# Altium project InterfaceSDRAM.PrjPcb
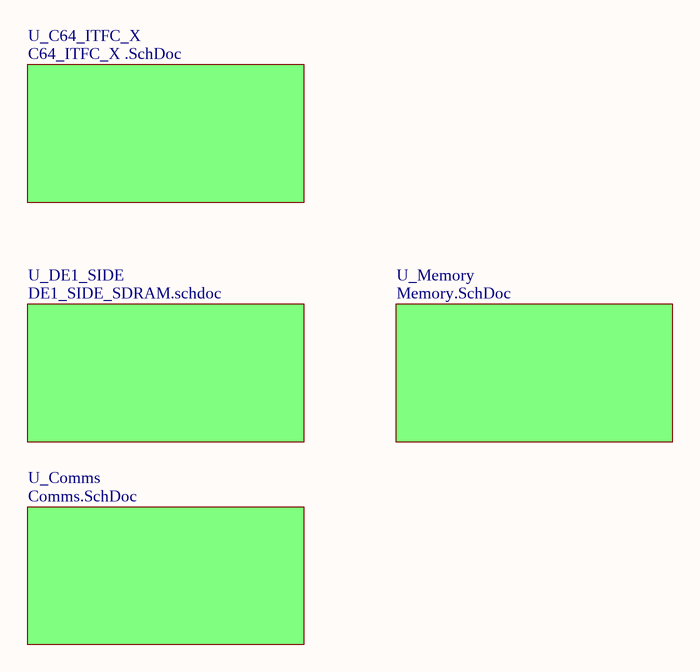
[diagram p0: C64IntfcTop.SchDoc]
5 sheets, 100 parts. Net scope: global (net labels, ports and power ports of the same name join across sheets).
Sheets:
  C64IntfcTop.SchDoc
    U_DE1_SIDE = DE1_SIDE_SDRAM.schdoc
    U_Memory = Memory.SchDoc
    U_Comms = Comms.SchDoc
    U_C64_ITFC_X = C64_ITFC_X .SchDoc

## Sheet C64IntfcTop.SchDoc
size A

### Sub-sheets
U_C64_ITFC_X = C64_ITFC_X .SchDoc: no entries
U_Comms = Comms.SchDoc: no entries
U_DE1_SIDE = DE1_SIDE_SDRAM.schdoc: no entries
U_Memory = Memory.SchDoc: no entries

## Sheet DE1_SIDE_SDRAM.schdoc
size B; SheetNumber: 3; SheetTotal: 3
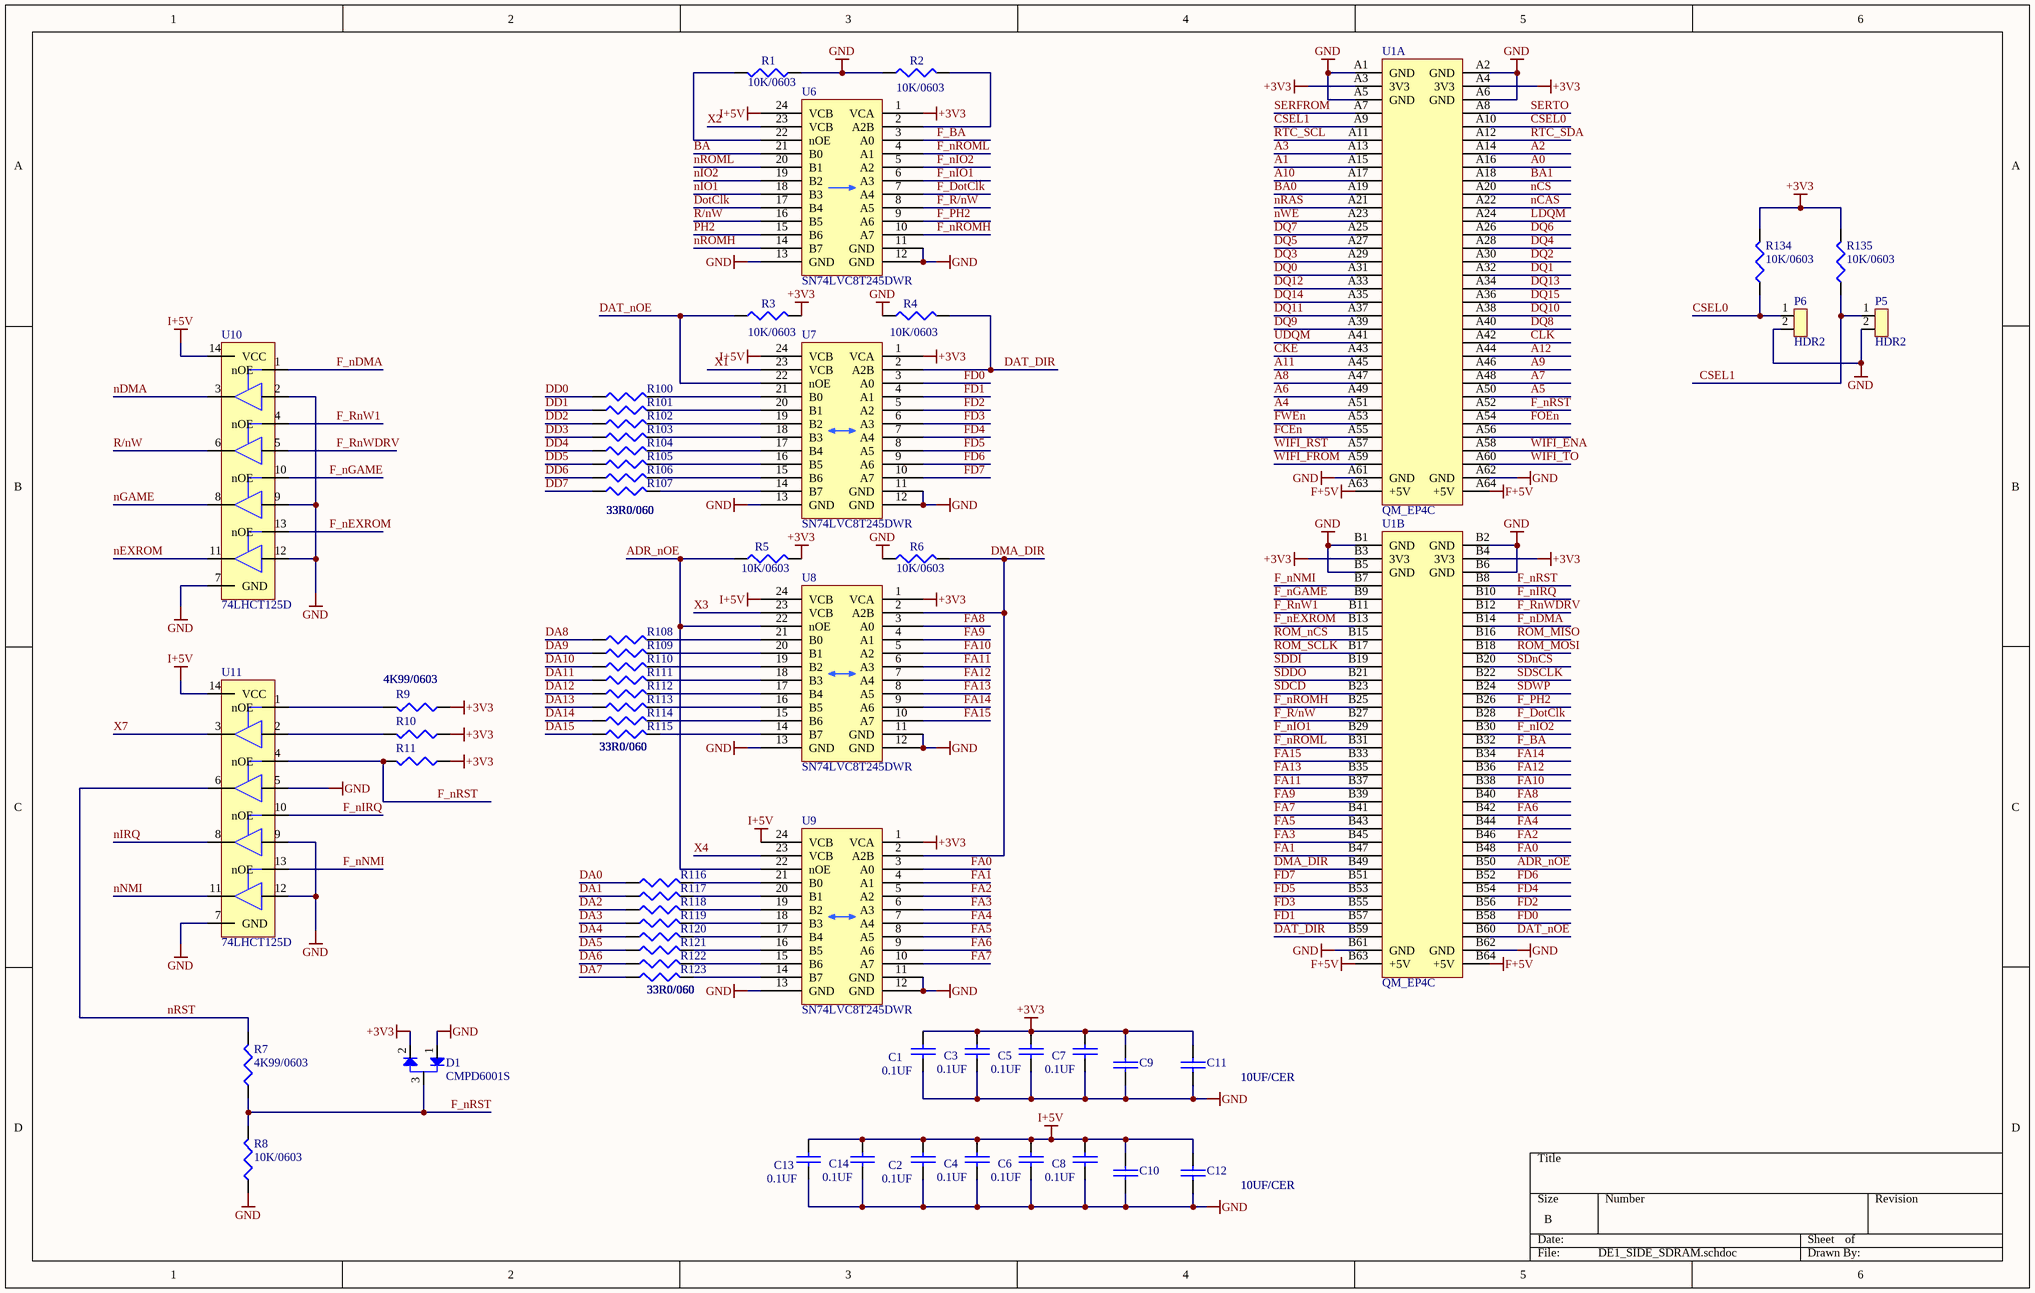
[diagram p1: DE1_SIDE_SDRAM.schdoc]

### Parts
C1  0.1UF  [0603]
C2  0.1UF  [0603]
C3  0.1UF  [0603]
C4  0.1UF  [0603]
C5  0.1UF  [0603]
C6  0.1UF  [0603]
C7  0.1UF  [0603]
C8  0.1UF  [0603]
C9  10UF/CER  [0805]
C10  10UF/CER  [0805]
C11  10UF/CER  [0805]
C12  10UF/CER  [0805]
C13  0.1UF  [0603]
C14  0.1UF  [0603]
D1  CMPD6001S  [SOT-23]
P5  HDR2  [HDR2]
P6  HDR2  [HDR2]
R1  10K/0603  [0603]
R2  10K/0603  [0603]
R3  10K/0603  [0603]
R4  10K/0603  [0603]
R5  10K/0603  [0603]
R6  10K/0603  [0603]
R7  4K99/0603  [0603]
R8  10K/0603  [0603]
R9  4K99/0603  [0603]
R10  4K99/0603  [0603]
R11  4K99/0603  [0603]
R100  33R0/060  [0603]
R101  33R0/060  [0603]
R102  33R0/060  [0603]
R103  33R0/060  [0603]
R104  33R0/060  [0603]
R105  33R0/060  [0603]
R106  33R0/060  [0603]
R107  33R0/060  [0603]
R108  33R0/060  [0603]
R109  33R0/060  [0603]
R110  33R0/060  [0603]
R111  33R0/060  [0603]
R112  33R0/060  [0603]
R113  33R0/060  [0603]
R114  33R0/060  [0603]
R115  33R0/060  [0603]
R116  33R0/060  [0603]
R117  33R0/060  [0603]
R118  33R0/060  [0603]
R119  33R0/060  [0603]
R120  33R0/060  [0603]
R121  33R0/060  [0603]
R122  33R0/060  [0603]
R123  33R0/060  [0603]
R134  10K/0603  [0603]
R135  10K/0603  [0603]
U1  QM_EP4C  [QMTECH_EP4CE15]  (parts A,B of 2)
U6  SN74LVC8T245DWR  [SOL-24]
U7  SN74LVC8T245DWR  [SOL-24]
U8  SN74LVC8T245DWR  [SOL-24]
U9  SN74LVC8T245DWR  [SOL-24]
U10  74LHCT125D  [SOP14]
U11  74LHCT125D  [SOP14]

### Nets
+3V3: C1.1 C3.1 C5.1 C7.1 C9.2 C11.2 D1.2 R3.2 R5.2 R9.1 R10.1 R11.1 R134.2 R135.2 U1.A3(3V3) U1.A4(3V3) U1.B3(3V3) U1.B4(3V3) U6.1(VCA) U7.1(VCA) U8.1(VCA) U9.1(VCA)
F+5V: U1.A63(+5V) U1.A64(+5V) U1.B63(+5V) U1.B64(+5V)
GND: C1.2 C2.2 C3.2 C4.2 C5.2 C6.2 C7.2 C8.2 C9.1 C10.1 C11.1 C12.1 C13.2 C14.2 D1.1 P5.2 P6.2 R1.1 R2.1 R4.1 R6.1 R8.1 U1.A1(GND) U1.A2(GND) U1.A5(GND) U1.A6(GND) U1.A61(GND) U1.A62(GND) U1.B1(GND) U1.B2(GND) U1.B5(GND) U1.B6(GND) U1.B61(GND) U1.B62(GND) U6.11(GND) U6.12(GND) U6.13(GND) U7.11(GND) U7.12(GND) U7.13(GND) U8.11(GND) U8.12(GND) U8.13(GND) U9.11(GND) U9.12(GND) U9.13(GND) U10.2 U10.7(GND) U10.9 U10.12 U11.5 U11.7(GND) U11.9 U11.12
I+5V: C2.1 C4.1 C6.1 C8.1 C10.2 C12.2 C13.1 C14.1 U6.24(VCB) U7.24(VCB) U8.24(VCB) U9.24(VCB) U10.14(VCC) U11.14(VCC)
A0: U1.A16
A1: U1.A15
A2: U1.A14
A3: U1.A13
A4: U1.A51
A5: U1.A50
A6: U1.A49
A7: U1.A48
A8: U1.A47
A9: U1.A46
A10: U1.A17
A11: U1.A45
A12: U1.A44
ADR_nOE: R5.1 U1.B50 U8.22(nOE) U9.22(nOE)
BA: U6.21(B0)
BA0: U1.A19
BA1: U1.A18
CKE: U1.A43
CLK: U1.A42
CSEL0: P6.1 R134.1 U1.A10
CSEL1: P5.1 R135.1 U1.A9
DA0: R116.1
DA1: R117.1
DA2: R118.1
DA3: R119.1
DA4: R120.1
DA5: R121.1
DA6: R122.1
DA7: R123.1
DA8: R108.1
DA9: R109.1
DA10: R110.1
DA11: R111.1
DA12: R112.1
DA13: R113.1
DA14: R114.1
DA15: R115.1
DAT_DIR: R4.2 U1.B59 U7.2(A2B)
DAT_nOE: R3.1 U1.B60 U7.22(nOE)
DD0: R100.1
DD1: R101.1
DD2: R102.1
DD3: R103.1
DD4: R104.1
DD5: R105.1
DD6: R106.1
DD7: R107.1
DMA_DIR: R6.2 U1.B49 U8.2(A2B) U9.2(A2B)
DotClk: U6.17(B4)
DQ0: U1.A31
DQ1: U1.A32
DQ2: U1.A30
DQ3: U1.A29
DQ4: U1.A28
DQ5: U1.A27
DQ6: U1.A26
DQ7: U1.A25
DQ8: U1.A40
DQ9: U1.A39
DQ10: U1.A38
DQ11: U1.A37
DQ12: U1.A33
DQ13: U1.A34
DQ14: U1.A35
DQ15: U1.A36
F_BA: U1.B32 U6.3(A0)
F_DotClk: U1.B28 U6.7(A4)
F_nDMA: U1.B14 U10.1(nOE)
F_nEXROM: U1.B13 U10.13(nOE)
F_nGAME: U1.B9 U10.10(nOE)
F_nIO1: U1.B29 U6.6(A3)
F_nIO2: U1.B30 U6.5(A2)
F_nIRQ: U1.B10 U11.10(nOE)
F_nNMI: U1.B7 U11.13(nOE)
F_nROMH: U1.B25 U6.10(A7)
F_nROML: U1.B31 U6.4(A1)
F_nRST: D1.3 R7.1 R8.2 R11.2 U1.A52 U1.B8 U11.4(nOE)
F_PH2: U1.B26 U6.9(A6)
F_R/nW: U1.B27 U6.8(A5)
F_RnW1: U1.B11 U10.4(nOE)
F_RnWDRV: U1.B12 U10.5
FA0: U1.B48 U9.3(A0)
FA1: U1.B47 U9.4(A1)
FA2: U1.B46 U9.5(A2)
FA3: U1.B45 U9.6(A3)
FA4: U1.B44 U9.7(A4)
FA5: U1.B43 U9.8(A5)
FA6: U1.B42 U9.9(A6)
FA7: U1.B41 U9.10(A7)
FA8: U1.B40 U8.3(A0)
FA9: U1.B39 U8.4(A1)
FA10: U1.B38 U8.5(A2)
FA11: U1.B37 U8.6(A3)
FA12: U1.B36 U8.7(A4)
FA13: U1.B35 U8.8(A5)
FA14: U1.B34 U8.9(A6)
FA15: U1.B33 U8.10(A7)
FCEn: U1.A55
FD0: U1.B58 U7.3(A0)
FD1: U1.B57 U7.4(A1)
FD2: U1.B56 U7.5(A2)
FD3: U1.B55 U7.6(A3)
FD4: U1.B54 U7.7(A4)
FD5: U1.B53 U7.8(A5)
FD6: U1.B52 U7.9(A6)
FD7: U1.B51 U7.10(A7)
FOEn: U1.A54
FWEn: U1.A53
LDQM: U1.A24
nCAS: U1.A22
nCS: U1.A20
nDMA: U10.3
nEXROM: U10.11
nGAME: U10.8
nIO1: U6.18(B3)
nIO2: U6.19(B2)
nIRQ: U11.8
nNMI: U11.11
nRAS: U1.A21
nROMH: U6.14(B7)
nROML: U6.20(B1)
nRST: R7.2 U11.6
nWE: U1.A23
PH2: U6.15(B6)
R/nW: U6.16(B5) U10.6
ROM_MISO: U1.B16
ROM_MOSI: U1.B18
ROM_nCS: U1.B15
ROM_SCLK: U1.B17
RTC_SCL: U1.A11
RTC_SDA: U1.A12
SDCD: U1.B23
SDDI: U1.B19
SDDO: U1.B21
SDnCS: U1.B20
SDSCLK: U1.B22
SDWP: U1.B24
SERFROM: U1.A7
SERTO: U1.A8
UDQM: U1.A41
WIFI_ENA: U1.A58
WIFI_FROM: U1.A59
WIFI_RST: U1.A57
WIFI_TO: U1.A60
X1: U7.23(VCB)
X2: U6.23(VCB)
X3: U8.23(VCB)
X4: U9.23(VCB)
X7: U11.3
NetR1_2: R1.2 U6.22(nOE)
NetR2_2: R2.2 U6.2(A2B)
NetR9_2: R9.2 U11.1(nOE)
NetR10_2: R10.2 U11.2
NetR100_2: R100.2 U7.21(B0)
NetR101_2: R101.2 U7.20(B1)
NetR102_2: R102.2 U7.19(B2)
NetR103_2: R103.2 U7.18(B3)
NetR104_2: R104.2 U7.17(B4)
NetR105_2: R105.2 U7.16(B5)
NetR106_2: R106.2 U7.15(B6)
NetR107_2: R107.2 U7.14(B7)
NetR108_2: R108.2 U8.21(B0)
NetR109_2: R109.2 U8.20(B1)
NetR110_2: R110.2 U8.19(B2)
NetR111_2: R111.2 U8.18(B3)
NetR112_2: R112.2 U8.17(B4)
NetR113_2: R113.2 U8.16(B5)
NetR114_2: R114.2 U8.15(B6)
NetR115_2: R115.2 U8.14(B7)
NetR116_2: R116.2 U9.21(B0)
NetR117_2: R117.2 U9.20(B1)
NetR118_2: R118.2 U9.19(B2)
NetR119_2: R119.2 U9.18(B3)
NetR120_2: R120.2 U9.17(B4)
NetR121_2: R121.2 U9.16(B5)
NetR122_2: R122.2 U9.15(B6)
NetR123_2: R123.2 U9.14(B7)

Not connected (* = marked no-connect by the designer): U1 A56

### Library data of the parts
C1-C8 C13 C14 = 0.1UF: CAP .10UF 16V CERAMIC X7R 0603; Text Field1: Kemet; Text Field2: C0603C104K4RACTU; Text Field3: 399-1096-1-ND; Text Field4: 1.17
C9-C12 = 10UF/CER: 10µF ±10% 25V Ceramic Capacitor X7S 0805; Text Field1: Murata; Text Field2: GRM21BC71E106KE11L; Text Field3: 490-10496-1-ND
D1 = CMPD6001S: Diode Array 1 Pair Series Connection Standard 75V 250mA Surface Mount TO-236-3, SC-59, SOT-23-3; MFG PN: CMPD6001S TR; DK PN: CMPD6001S CT-ND; MFG: Central Semiconductor; FOOTPRINT: SOT23; Populate: *
R1-R6 = 10K/0603: RES 10.0K OHM 1/10W 1% 0603 SMD; Text Field1: Dale/Vishay; Text Field2: CRCW060310K0FKEA; Text Field3: 541-10.0KHCT-ND; Text Field4: 5.02
R7 R9-R11 = 4K99/0603: RES 4.99K OHM 1/10W 1% 0603 SMD; MFG: Dale/Vishay; MFG PN: CRCW06034K99FKEAC; DK PN: 541-3985-1-ND; Price: 5.02
R8 R134 R135 = 10K/0603: RES 10.0K OHM 1/10W 1% 0603 SMD; MFG: Dale/Vishay; MFG PN: CRCW060310K0FKEA; DK PN: 541-10.0KHCT-ND; Price: 5.02
R100-R123 = 33R0/060: 33 Ohms ±1% 0.1W, 1/10W Chip Resistor 0603 (1608 Metric) Moisture Resistant Thick Film; MFG: Yaego; MFG PN: RC0603FR-0733RL; DK PN: 311-33.0HRCT-ND
U6-U9 = SN74LVC8T245DWR: Voltage Level Translator Bidirectional 1 Circuit 8 Channel 24-SOIC; MFG: TI; DK PN: 296-23280-1-ND; MFG PN: SN74LVC8T245DWR; Price: 1.02
U10 U11 = 74LHCT125D: Buffer, Non-Inverting 4 Element 1 Bit per Element 3-State Output 14-SOIC; MFG: Nexpiria; MFG PN: 74HCT125D,653; DK PN: 1727-2834-2-ND; Price: 1.17

## Sheet Memory.SchDoc
size B
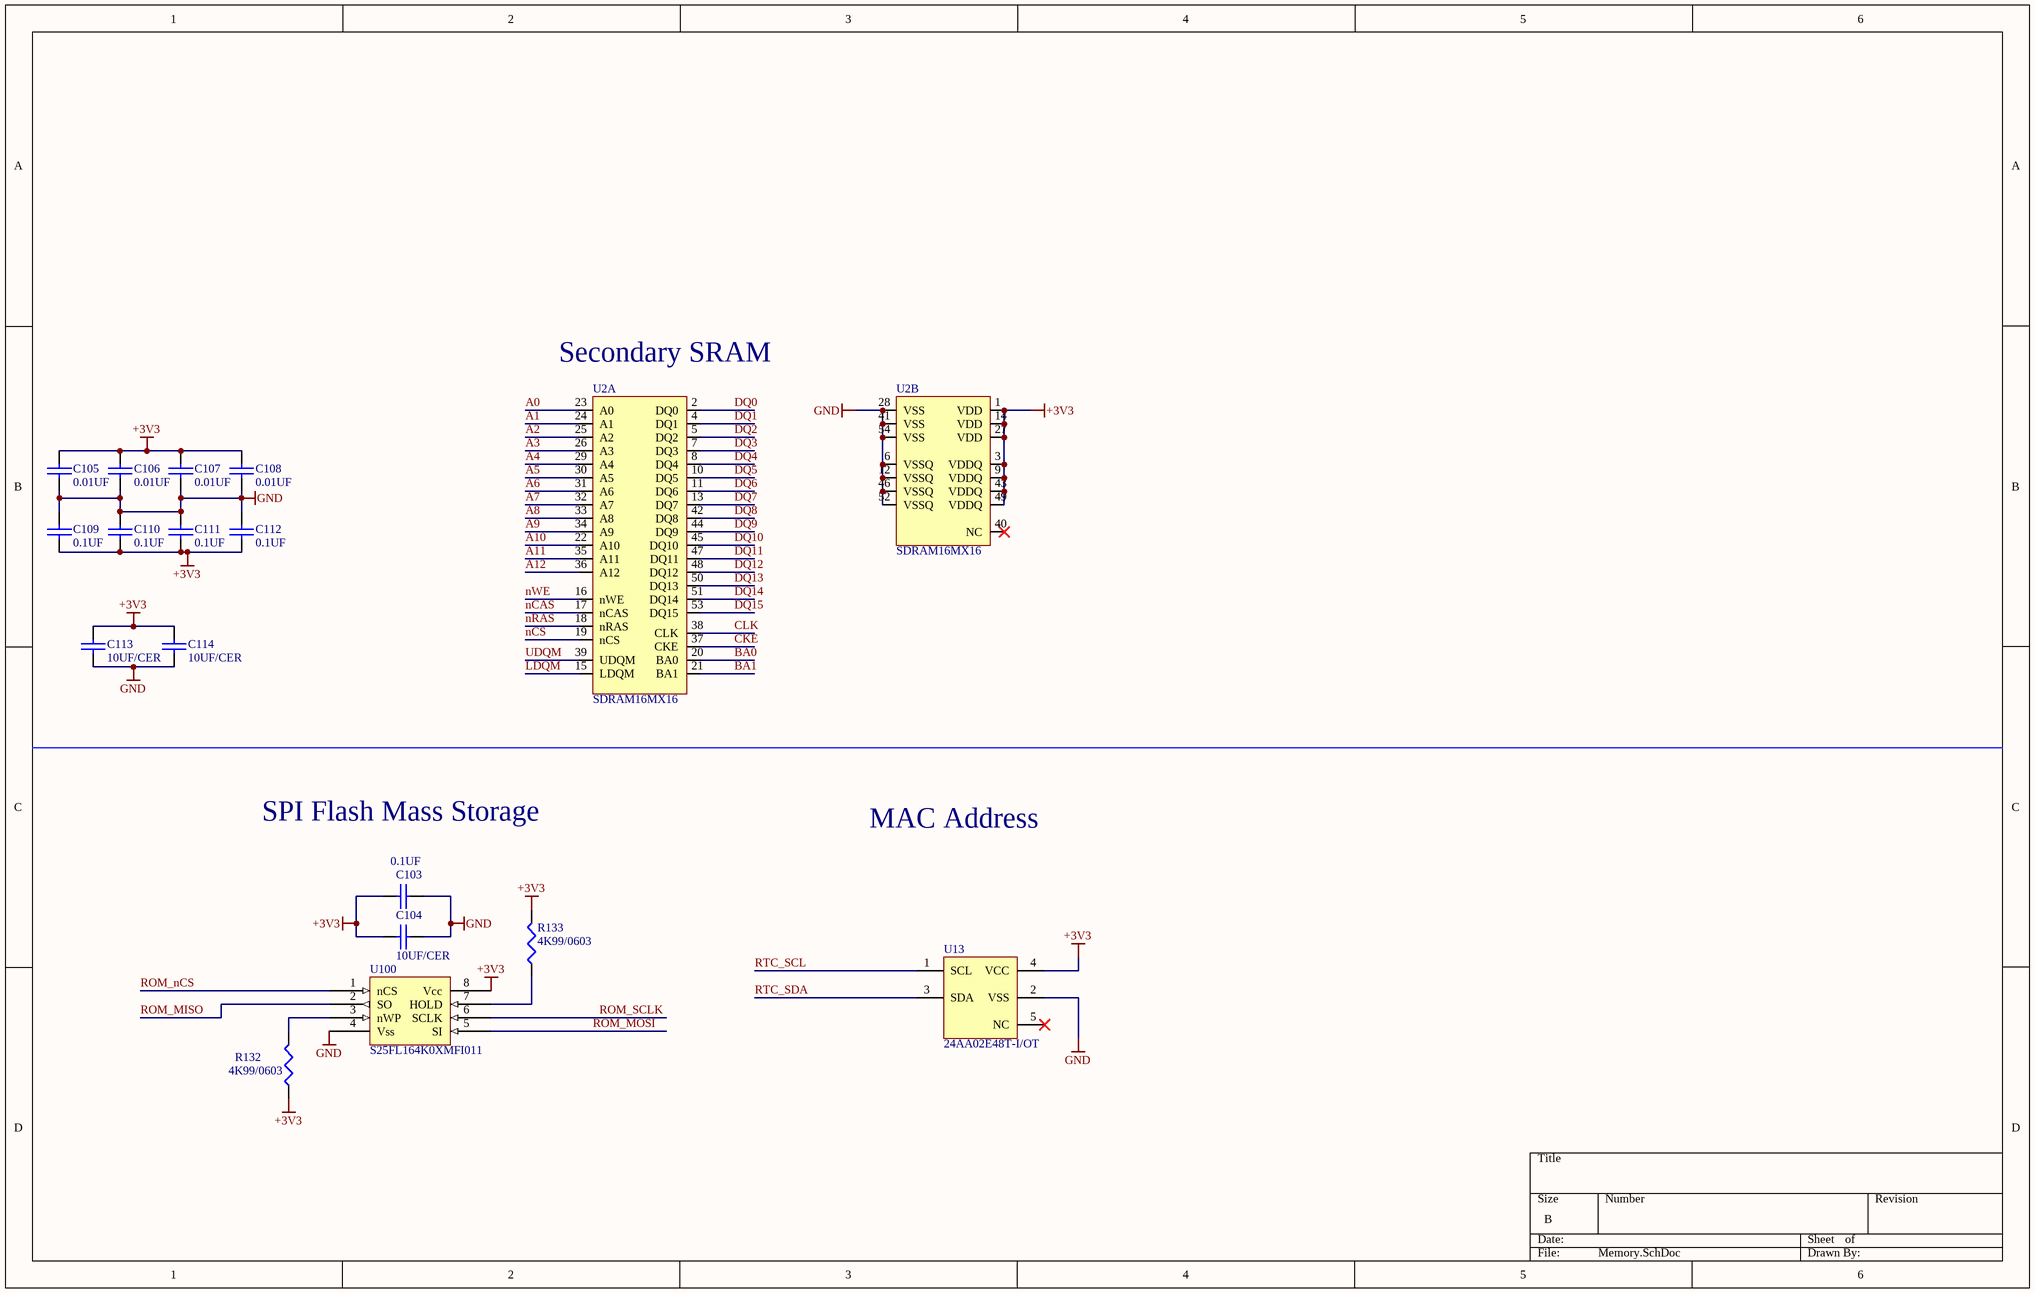
[diagram p2: Memory.SchDoc]

### Parts
C103  0.1UF  [0603]
C104  10UF/CER  [0805]
C105  0.01UF  [0603]
C106  0.01UF  [0603]
C107  0.01UF  [0603]
C108  0.01UF  [0603]
C109  0.1UF  [0603]
C110  0.1UF  [0603]
C111  0.1UF  [0603]
C112  0.1UF  [0603]
C113  10UF/CER  [0805]
C114  10UF/CER  [0805]
R132  4K99/0603  [0603]
R133  4K99/0603  [0603]
U2  SDRAM16MX16  [SOP54]  (parts A,B of 2)
U13  24AA02E48T-I/OT  [SOT23-5]
U100  S25FL164K0XMFI011  [SOC008]

### Nets
+3V3: C103.1 C104.1 C105.1 C106.1 C107.1 C108.1 C109.2 C110.2 C111.2 C112.2 C113.2 C114.2 R132.1 R133.2 U2.1(VDD) U2.3(VDDQ) U2.9(VDDQ) U2.14(VDD) U2.27(VDD) U2.43(VDDQ) U2.49(VDDQ) U13.4(VCC) U100.8(Vcc)
GND: C103.2 C104.2 C105.2 C106.2 C107.2 C108.2 C109.1 C110.1 C111.1 C112.1 C113.1 C114.1 U2.6(VSSQ) U2.12(VSSQ) U2.28(VSS) U2.41(VSS) U2.46(VSSQ) U2.52(VSSQ) U2.54(VSS) U13.2(VSS) U100.4(Vss)
A0: U2.23(A0)
A1: U2.24(A1)
A2: U2.25(A2)
A3: U2.26(A3)
A4: U2.29(A4)
A5: U2.30(A5)
A6: U2.31(A6)
A7: U2.32(A7)
A8: U2.33(A8)
A9: U2.34(A9)
A10: U2.22(A10)
A11: U2.35(A11)
A12: U2.36(A12)
BA0: U2.20(BA0)
BA1: U2.21(BA1)
CKE: U2.37(CKE)
CLK: U2.38(CLK)
DQ0: U2.2(DQ0)
DQ1: U2.4(DQ1)
DQ2: U2.5(DQ2)
DQ3: U2.7(DQ3)
DQ4: U2.8(DQ4)
DQ5: U2.10(DQ5)
DQ6: U2.11(DQ6)
DQ7: U2.13(DQ7)
DQ8: U2.42(DQ8)
DQ9: U2.44(DQ9)
DQ10: U2.45(DQ10)
DQ11: U2.47(DQ11)
DQ12: U2.48(DQ12)
DQ13: U2.50(DQ13)
DQ14: U2.51(DQ14)
DQ15: U2.53(DQ15)
LDQM: U2.15(LDQM)
nCAS: U2.17(nCAS)
nCS: U2.19(nCS)
nRAS: U2.18(nRAS)
nWE: U2.16(nWE)
ROM_MISO: U100.2(SO)
ROM_MOSI: U100.5(SI)
ROM_nCS: U100.1(nCS)
ROM_SCLK: U100.6(SCLK)
RTC_SCL: U13.1(SCL)
RTC_SDA: U13.3(SDA)
UDQM: U2.39(UDQM)
NetR132_2: R132.2 U100.3(nWP)
NetR133_1: R133.1 U100.7(HOLD)

Not connected (* = marked no-connect by the designer): U2 40(NC)*; U13 5(NC)*

### Notes on the sheet
- (near U2) Secondary SRAM
- SPI Flash Mass Storage
- MAC Address

### Library data of the parts
C103 C109-C112 = 0.1UF: CAP .10UF 16V CERAMIC X7R 0603; MFG: Kemet; MFG PN: C0603C104K4RACTU; DK PN: 399-1096-1-ND; Price: 1.17
C104 C113 C114 = 10UF/CER: as C9 on sheet DE1_SIDE_SDRAM
C105-C108 = 0.01UF: 10000pF ±10% 10V Ceramic Capacitor X7R 0603 (1608 Metric); MFG: Kemet; MFG PN: C0603C103K8RACTU; DK PN: 399-11132-1-ND; Price: 1.17
R132 R133 = 4K99/0603: as R7 on sheet DE1_SIDE_SDRAM; Price: 5.02
U2 = SDRAM16MX16: SDRAM Memory IC 256Mb (16M x 16) Parallel 166MHz 5ns 54-TSOP II; MFG: Winbond; MFG PN: W9825G6KH-6; DK PN: W9825G6KH-6-ND
U13 = 24AA02E48T-I/OT: IC EEPROM 2KBIT 400KHZ SOT23-5; MFG: Microchip; DK PN: 24AA02E48T-I/OTCT-ND; MFG PN: 24AA02E48T-I/OT
U100 = S25FL164K0XMFI011: IC FLASH 64MBIT 108MHZ 8SOIC; Text Field1: Cyoress; Text Field3: 1274-1097-ND; Text Field2: S25FL164K0XMFI011

## Sheet Comms.SchDoc
size A
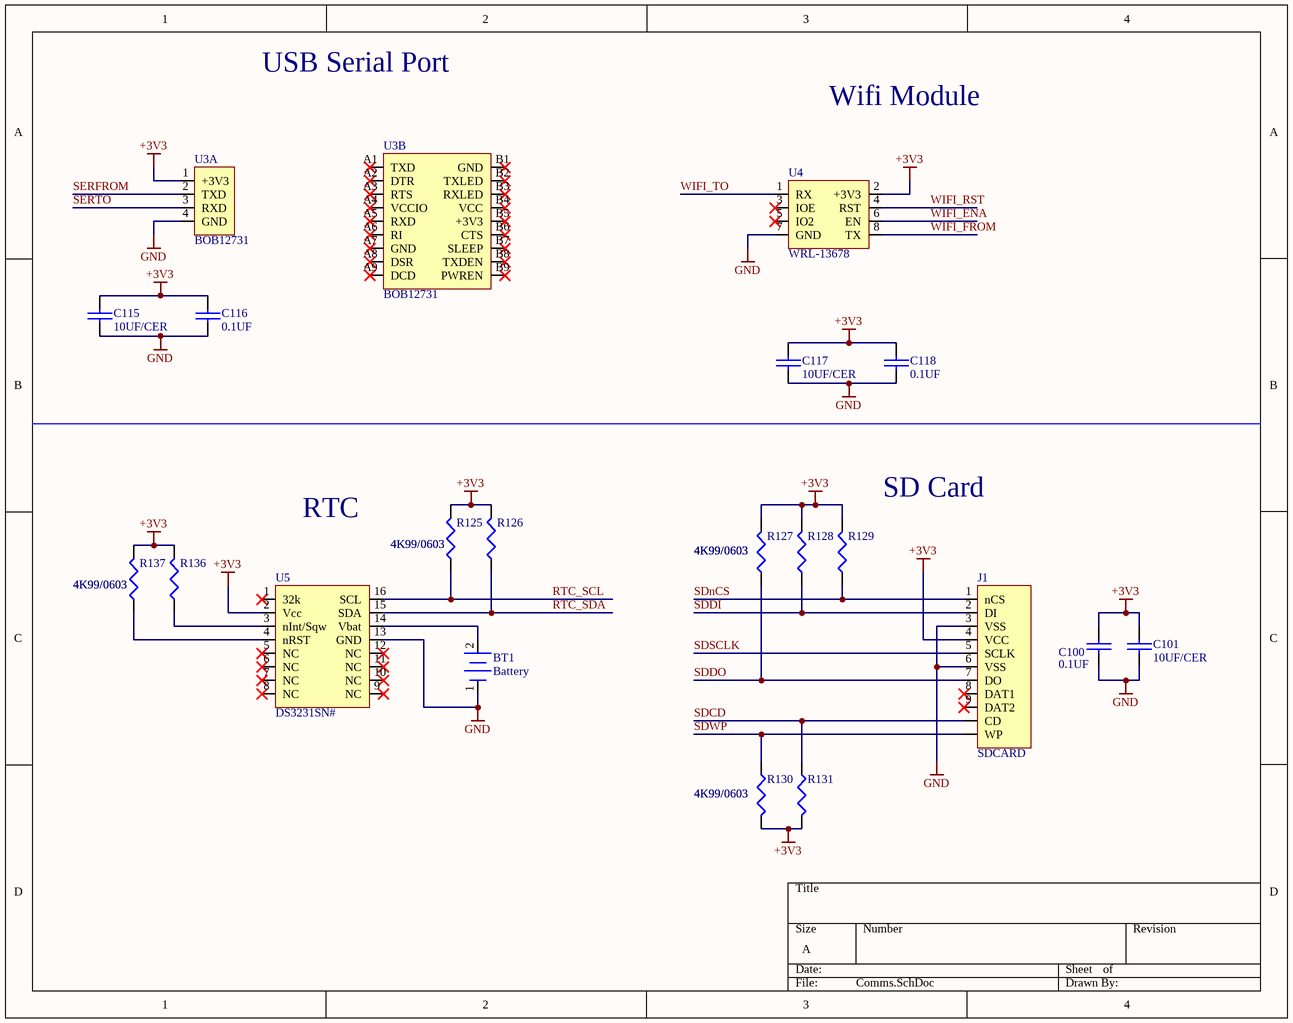
[diagram p3: Comms.SchDoc]

### Parts
BT1  Battery  [BC501SM]
C100  0.1UF  [0603]
C101  10UF/CER  [0805]
C115  10UF/CER  [0805]
C116  0.1UF  [0603]
C117  10UF/CER  [0805]
C118  0.1UF  [0603]
J1  SDCARD  [SDCARD2041021]
R125  4K99/0603  [0603]
R126  4K99/0603  [0603]
R127  4K99/0603  [0603]
R128  4K99/0603  [0603]
R129  4K99/0603  [0603]
R130  4K99/0603  [0603]
R131  4K99/0603  [0603]
R136  4K99/0603  [0603]
R137  4K99/0603  [0603]
U3  BOB12731  [BOB12731]  (parts A,B of 2)
U4  WRL-13678  [WRL13678]
U5  DS3231SN#  [SOL16]

### Nets
+3V3: C100.1 C101.2 C115.2 C116.1 C117.2 C118.1 J1.4(VCC) R125.2 R126.2 R127.2 R128.2 R129.2 R130.2 R131.2 R136.2 R137.2 U3.1(+3V3) U4.2(+3V3) U5.2(Vcc)
GND: BT1.1 C100.2 C101.1 C115.1 C116.2 C117.1 C118.2 J1.3(VSS) J1.6(VSS) U3.4(GND) U4.7(GND) U5.13(GND)
RTC_SCL: R125.1 U5.16(SCL)
RTC_SDA: R126.1 U5.15(SDA)
SDCD: J1.CD R131.1
SDDI: J1.2(DI) R128.1
SDDO: J1.7(DO) R127.1
SDnCS: J1.1(nCS) R129.1
SDSCLK: J1.5(SCLK)
SDWP: J1.WP R130.1
SERFROM: U3.2(TXD)
SERTO: U3.3(RXD)
WIFI_ENA: U4.6(EN)
WIFI_FROM: U4.8(TX)
WIFI_RST: U4.4(RST)
WIFI_TO: U4.1(RX)
NetBT1_2: BT1.2 U5.14(Vbat)
NetR136_1: R136.1 U5.3(nInt/Sqw)
NetR137_1: R137.1 U5.4(nRST)

Not connected (* = marked no-connect by the designer): J1 8(DAT1)* 9(DAT2)*; U3 A1(TXD)* A2(DTR)* A3(RTS)* A4(VCCIO)* A5(RXD)* A6(RI)* A7(GND)* A8(DSR)* A9(DCD)* B1(GND)* B2(TXLED)* B3(RXLED)* B4(VCC)* B5(+3V3)* B6(CTS)* B7(SLEEP)* B8(TXDEN)* B9(PWREN)*; U4 3(IOE)* 5(IO2)*; U5 1(32k)* 5(NC)* 6(NC)* 7(NC)* 8(NC)* 9(NC)* 10(NC)* 11(NC)* 12(NC)*

### Notes on the sheet
- USB Serial Port
- Wifi Module
- (near R129) SD Card
- RTC

### Library data of the parts
BT1 = BC501SM-TR: Battery Holder (Open) Coin, 12.0mm 1 Cell SMD (SMT) Tab; MFG: MPD; DK PN: BC501SM-TR-ND; MFG PN: BC501SM-TR; Price: 1.17
C100 = 0.1UF: as C1 on sheet DE1_SIDE_SDRAM
C101 C115 C117 = 10UF/CER: as C9 on sheet DE1_SIDE_SDRAM
C116 C118 = 0.1UF: as C103 on sheet Memory; Price: 1.17
J1 = SDCARD: 11 (9 + 2) Position Card Connector Secure Digital - SD Surface Mount, Right Angle Gold; MFG: TE; MFG PN: 2041021-4; DK PN: A101492CT-ND; Price: 3.69
R125-R131 R136 R137 = 4K99/0603: as R7 on sheet DE1_SIDE_SDRAM; Price: 5.02
U3 = BOB12731: FT232R USB 2.0 to UART Interface Evaluation Board; MFG: SparkFun; MFG PN: BOB-12731; DK PN: 1568-1195-ND; Price: 1.17
U4 = WRL-13678: WiFi 802.11b/g/n Transceiver Module 2.4GHz ~ 2.48GHz Integrated, Trace Through Hole; MFG: SparkFun; DK PN: 1568-1235-ND; MFG PN: WRL-13678; Price: 1.17
U5 = DS3231SN#: Real Time Clock (RTC) IC Clock/Calendar I²C, 2-Wire Serial 16-SOIC (0.295", 7.50mm Width); MFG: Maxim; DK PN: DS3231SN#-ND; MFG PN: DS3231SN#; Price: 9.79

## Sheet C64_ITFC_X .SchDoc
size B; SheetNumber: 2; SheetTotal: 3
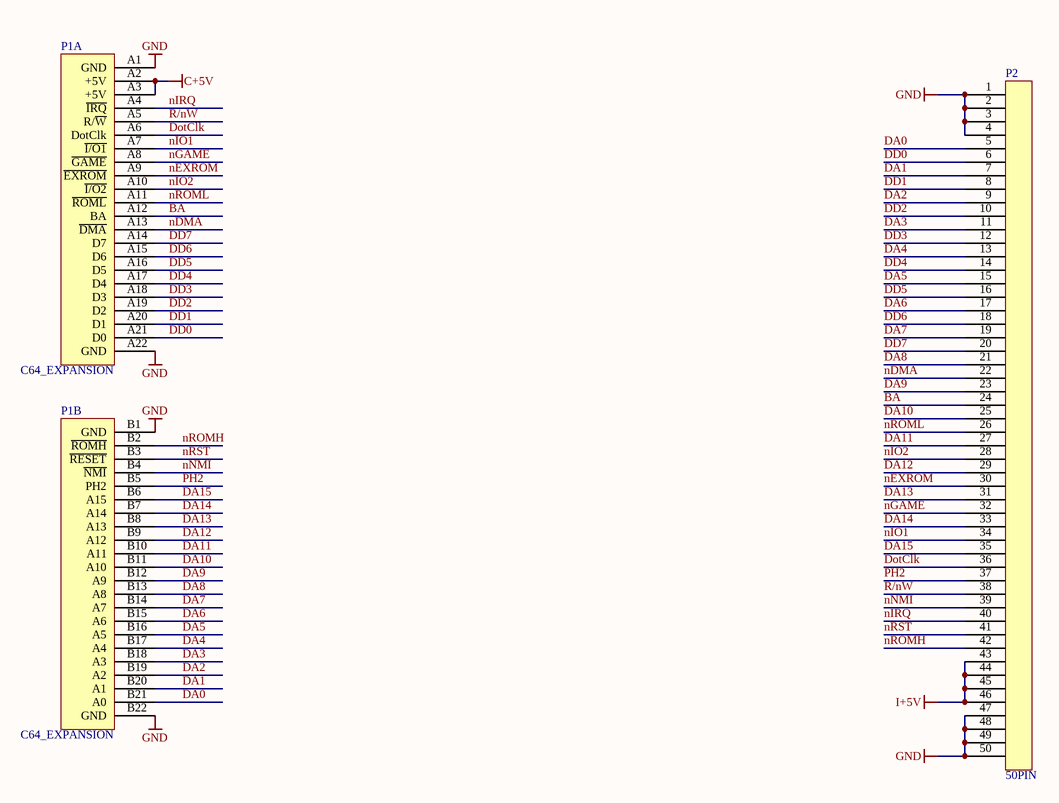
[diagram p4: C64_ITFC_X .SchDoc]

### Parts
P1  C64_EXPANSION  [C64_EXPANSION]  (parts A,B of 2)
P2  50PIN  [IDC50_40]

### Nets
C+5V: P1.A2(+5V) P1.A3(+5V)
GND: P1.A1(GND) P1.A22(GND) P1.B1(GND) P1.B22(GND) P2.1 P2.2 P2.3 P2.4 P2.47 P2.48 P2.49 P2.50
I+5V: P2.43 P2.44 P2.45 P2.46
BA: P1.A12(BA) P2.24
DA0: P1.B21(A0) P2.5
DA1: P1.B20(A1) P2.7
DA2: P1.B19(A2) P2.9
DA3: P1.B18(A3) P2.11
DA4: P1.B17(A4) P2.13
DA5: P1.B16(A5) P2.15
DA6: P1.B15(A6) P2.17
DA7: P1.B14(A7) P2.19
DA8: P1.B13(A8) P2.21
DA9: P1.B12(A9) P2.23
DA10: P1.B11(A10) P2.25
DA11: P1.B10(A11) P2.27
DA12: P1.B9(A12) P2.29
DA13: P1.B8(A13) P2.31
DA14: P1.B7(A14) P2.33
DA15: P1.B6(A15) P2.35
DD0: P1.A21(D0) P2.6
DD1: P1.A20(D1) P2.8
DD2: P1.A19(D2) P2.10
DD3: P1.A18(D3) P2.12
DD4: P1.A17(D4) P2.14
DD5: P1.A16(D5) P2.16
DD6: P1.A15(D6) P2.18
DD7: P1.A14(D7) P2.20
DotClk: P1.A6(DotClk) P2.36
nDMA: P1.A13(~{DMA}) P2.22
nEXROM: P1.A9(~{EXROM}) P2.30
nGAME: P1.A8(~{GAME}) P2.32
nIO1: P1.A7(~{I/O1}) P2.34
nIO2: P1.A10(~{I/O2}) P2.28
nIRQ: P1.A4(~{IRQ}) P2.40
nNMI: P1.B4(~{NMI}) P2.39
nROMH: P1.B2(~{ROMH}) P2.42
nROML: P1.A11(~{ROML}) P2.26
nRST: P1.B3(~{RESET}) P2.41
PH2: P1.B5(PH2) P2.37
R/nW: P1.A5(R/~{W}) P2.38

### Library data of the parts
P1 = C64_EXPANSION: C64 Expansion Connector

## Nets that join several sheets
+3V3: DE1_SIDE_SDRAM (22 pins), Memory (23 pins), Comms (19 pins)
GND: DE1_SIDE_SDRAM (54 pins), Memory (21 pins), Comms (12 pins), C64_ITFC_X  (12 pins)
I+5V: DE1_SIDE_SDRAM (14 pins), C64_ITFC_X  (P2.43 P2.44 P2.45 P2.46)
A0: DE1_SIDE_SDRAM (U1.A16), Memory (U2.23)
A1: DE1_SIDE_SDRAM (U1.A15), Memory (U2.24)
A2: DE1_SIDE_SDRAM (U1.A14), Memory (U2.25)
A3: DE1_SIDE_SDRAM (U1.A13), Memory (U2.26)
A4: DE1_SIDE_SDRAM (U1.A51), Memory (U2.29)
A5: DE1_SIDE_SDRAM (U1.A50), Memory (U2.30)
A6: DE1_SIDE_SDRAM (U1.A49), Memory (U2.31)
A7: DE1_SIDE_SDRAM (U1.A48), Memory (U2.32)
A8: DE1_SIDE_SDRAM (U1.A47), Memory (U2.33)
A9: DE1_SIDE_SDRAM (U1.A46), Memory (U2.34)
A10: DE1_SIDE_SDRAM (U1.A17), Memory (U2.22)
A11: DE1_SIDE_SDRAM (U1.A45), Memory (U2.35)
A12: DE1_SIDE_SDRAM (U1.A44), Memory (U2.36)
BA: DE1_SIDE_SDRAM (U6.21), C64_ITFC_X  (P1.A12 P2.24)
BA0: DE1_SIDE_SDRAM (U1.A19), Memory (U2.20)
BA1: DE1_SIDE_SDRAM (U1.A18), Memory (U2.21)
CKE: DE1_SIDE_SDRAM (U1.A43), Memory (U2.37)
CLK: DE1_SIDE_SDRAM (U1.A42), Memory (U2.38)
DA0: DE1_SIDE_SDRAM (R116.1), C64_ITFC_X  (P1.B21 P2.5)
DA1: DE1_SIDE_SDRAM (R117.1), C64_ITFC_X  (P1.B20 P2.7)
DA2: DE1_SIDE_SDRAM (R118.1), C64_ITFC_X  (P1.B19 P2.9)
DA3: DE1_SIDE_SDRAM (R119.1), C64_ITFC_X  (P1.B18 P2.11)
DA4: DE1_SIDE_SDRAM (R120.1), C64_ITFC_X  (P1.B17 P2.13)
DA5: DE1_SIDE_SDRAM (R121.1), C64_ITFC_X  (P1.B16 P2.15)
DA6: DE1_SIDE_SDRAM (R122.1), C64_ITFC_X  (P1.B15 P2.17)
DA7: DE1_SIDE_SDRAM (R123.1), C64_ITFC_X  (P1.B14 P2.19)
DA8: DE1_SIDE_SDRAM (R108.1), C64_ITFC_X  (P1.B13 P2.21)
DA9: DE1_SIDE_SDRAM (R109.1), C64_ITFC_X  (P1.B12 P2.23)
DA10: DE1_SIDE_SDRAM (R110.1), C64_ITFC_X  (P1.B11 P2.25)
DA11: DE1_SIDE_SDRAM (R111.1), C64_ITFC_X  (P1.B10 P2.27)
DA12: DE1_SIDE_SDRAM (R112.1), C64_ITFC_X  (P1.B9 P2.29)
DA13: DE1_SIDE_SDRAM (R113.1), C64_ITFC_X  (P1.B8 P2.31)
DA14: DE1_SIDE_SDRAM (R114.1), C64_ITFC_X  (P1.B7 P2.33)
DA15: DE1_SIDE_SDRAM (R115.1), C64_ITFC_X  (P1.B6 P2.35)
DD0: DE1_SIDE_SDRAM (R100.1), C64_ITFC_X  (P1.A21 P2.6)
DD1: DE1_SIDE_SDRAM (R101.1), C64_ITFC_X  (P1.A20 P2.8)
DD2: DE1_SIDE_SDRAM (R102.1), C64_ITFC_X  (P1.A19 P2.10)
DD3: DE1_SIDE_SDRAM (R103.1), C64_ITFC_X  (P1.A18 P2.12)
DD4: DE1_SIDE_SDRAM (R104.1), C64_ITFC_X  (P1.A17 P2.14)
DD5: DE1_SIDE_SDRAM (R105.1), C64_ITFC_X  (P1.A16 P2.16)
DD6: DE1_SIDE_SDRAM (R106.1), C64_ITFC_X  (P1.A15 P2.18)
DD7: DE1_SIDE_SDRAM (R107.1), C64_ITFC_X  (P1.A14 P2.20)
DotClk: DE1_SIDE_SDRAM (U6.17), C64_ITFC_X  (P1.A6 P2.36)
DQ0: DE1_SIDE_SDRAM (U1.A31), Memory (U2.2)
DQ1: DE1_SIDE_SDRAM (U1.A32), Memory (U2.4)
DQ2: DE1_SIDE_SDRAM (U1.A30), Memory (U2.5)
DQ3: DE1_SIDE_SDRAM (U1.A29), Memory (U2.7)
DQ4: DE1_SIDE_SDRAM (U1.A28), Memory (U2.8)
DQ5: DE1_SIDE_SDRAM (U1.A27), Memory (U2.10)
DQ6: DE1_SIDE_SDRAM (U1.A26), Memory (U2.11)
DQ7: DE1_SIDE_SDRAM (U1.A25), Memory (U2.13)
DQ8: DE1_SIDE_SDRAM (U1.A40), Memory (U2.42)
DQ9: DE1_SIDE_SDRAM (U1.A39), Memory (U2.44)
DQ10: DE1_SIDE_SDRAM (U1.A38), Memory (U2.45)
DQ11: DE1_SIDE_SDRAM (U1.A37), Memory (U2.47)
DQ12: DE1_SIDE_SDRAM (U1.A33), Memory (U2.48)
DQ13: DE1_SIDE_SDRAM (U1.A34), Memory (U2.50)
DQ14: DE1_SIDE_SDRAM (U1.A35), Memory (U2.51)
DQ15: DE1_SIDE_SDRAM (U1.A36), Memory (U2.53)
LDQM: DE1_SIDE_SDRAM (U1.A24), Memory (U2.15)
nCAS: DE1_SIDE_SDRAM (U1.A22), Memory (U2.17)
nCS: DE1_SIDE_SDRAM (U1.A20), Memory (U2.19)
nDMA: DE1_SIDE_SDRAM (U10.3), C64_ITFC_X  (P1.A13 P2.22)
nEXROM: DE1_SIDE_SDRAM (U10.11), C64_ITFC_X  (P1.A9 P2.30)
nGAME: DE1_SIDE_SDRAM (U10.8), C64_ITFC_X  (P1.A8 P2.32)
nIO1: DE1_SIDE_SDRAM (U6.18), C64_ITFC_X  (P1.A7 P2.34)
nIO2: DE1_SIDE_SDRAM (U6.19), C64_ITFC_X  (P1.A10 P2.28)
nIRQ: DE1_SIDE_SDRAM (U11.8), C64_ITFC_X  (P1.A4 P2.40)
nNMI: DE1_SIDE_SDRAM (U11.11), C64_ITFC_X  (P1.B4 P2.39)
nRAS: DE1_SIDE_SDRAM (U1.A21), Memory (U2.18)
nROMH: DE1_SIDE_SDRAM (U6.14), C64_ITFC_X  (P1.B2 P2.42)
nROML: DE1_SIDE_SDRAM (U6.20), C64_ITFC_X  (P1.A11 P2.26)
nRST: DE1_SIDE_SDRAM (R7.2 U11.6), C64_ITFC_X  (P1.B3 P2.41)
nWE: DE1_SIDE_SDRAM (U1.A23), Memory (U2.16)
PH2: DE1_SIDE_SDRAM (U6.15), C64_ITFC_X  (P1.B5 P2.37)
R/nW: DE1_SIDE_SDRAM (U6.16 U10.6), C64_ITFC_X  (P1.A5 P2.38)
ROM_MISO: DE1_SIDE_SDRAM (U1.B16), Memory (U100.2)
ROM_MOSI: DE1_SIDE_SDRAM (U1.B18), Memory (U100.5)
ROM_nCS: DE1_SIDE_SDRAM (U1.B15), Memory (U100.1)
ROM_SCLK: DE1_SIDE_SDRAM (U1.B17), Memory (U100.6)
RTC_SCL: DE1_SIDE_SDRAM (U1.A11), Memory (U13.1), Comms (R125.1 U5.16)
RTC_SDA: DE1_SIDE_SDRAM (U1.A12), Memory (U13.3), Comms (R126.1 U5.15)
SDCD: DE1_SIDE_SDRAM (U1.B23), Comms (J1.CD R131.1)
SDDI: DE1_SIDE_SDRAM (U1.B19), Comms (J1.2 R128.1)
SDDO: DE1_SIDE_SDRAM (U1.B21), Comms (J1.7 R127.1)
SDnCS: DE1_SIDE_SDRAM (U1.B20), Comms (J1.1 R129.1)
SDSCLK: DE1_SIDE_SDRAM (U1.B22), Comms (J1.5)
SDWP: DE1_SIDE_SDRAM (U1.B24), Comms (J1.WP R130.1)
SERFROM: DE1_SIDE_SDRAM (U1.A7), Comms (U3.2)
SERTO: DE1_SIDE_SDRAM (U1.A8), Comms (U3.3)
UDQM: DE1_SIDE_SDRAM (U1.A41), Memory (U2.39)
WIFI_ENA: DE1_SIDE_SDRAM (U1.A58), Comms (U4.6)
WIFI_FROM: DE1_SIDE_SDRAM (U1.A59), Comms (U4.8)
WIFI_RST: DE1_SIDE_SDRAM (U1.A57), Comms (U4.4)
WIFI_TO: DE1_SIDE_SDRAM (U1.A60), Comms (U4.1)